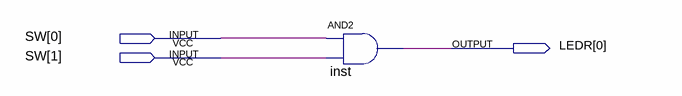
[diagram p0: schematic sheet]
// Quartus schematic Gatedemo.bdf as structural Verilog: 1 symbols, 3 pins
module Gatedemo (
  input  [1:0] SW,
  output [0:0] LEDR
);

  and inst (LEDR[0], SW[0], SW[1]);
endmodule
